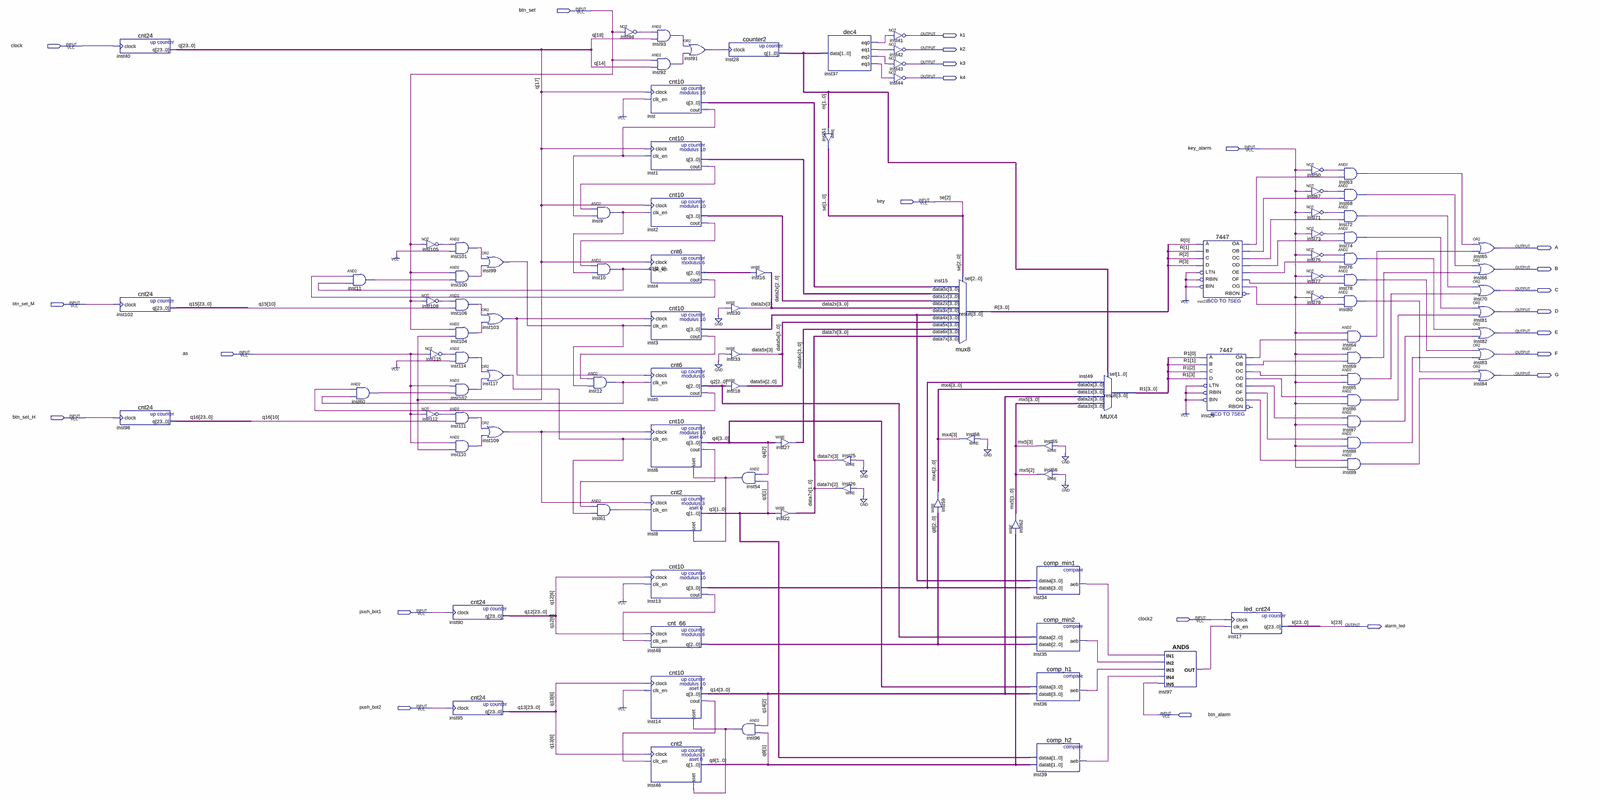
[diagram p0: schematic sheet, whole]
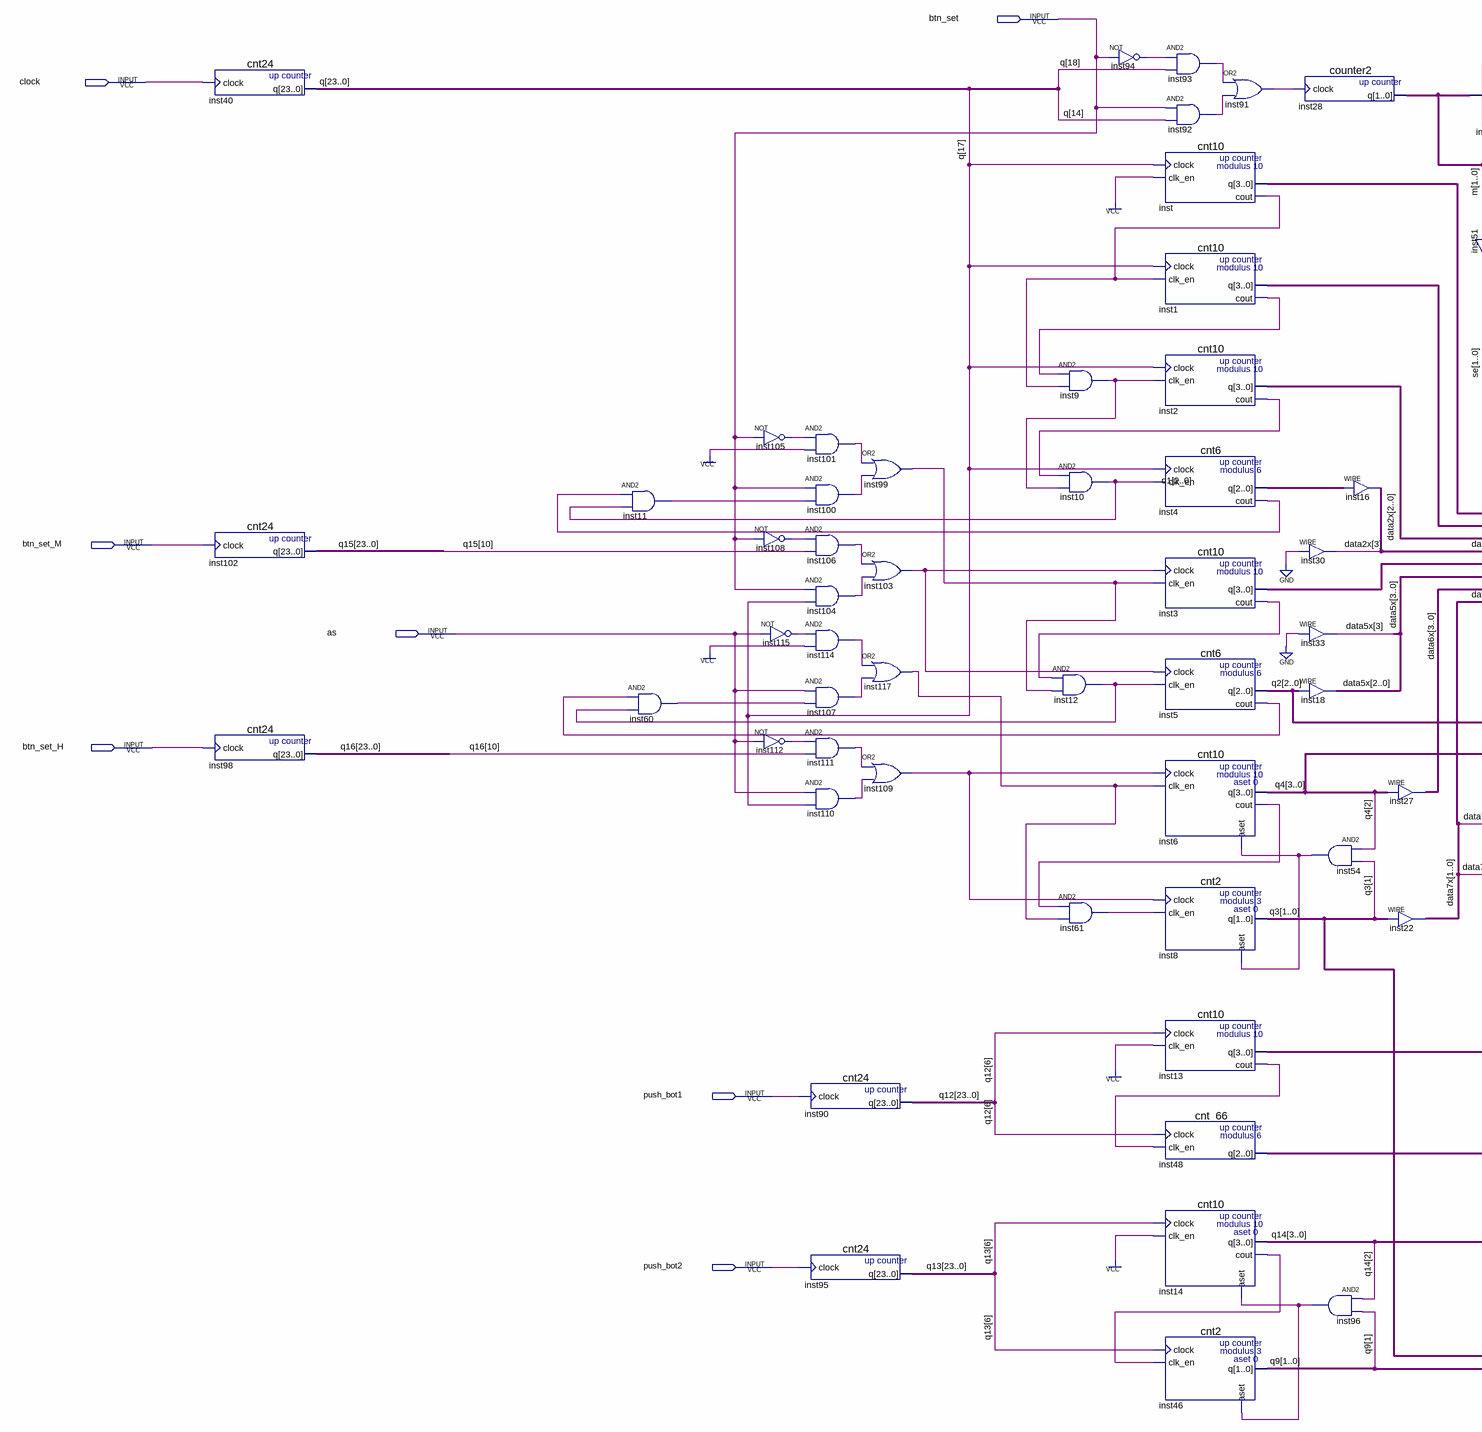
[diagram p1: schematic sheet, left part]
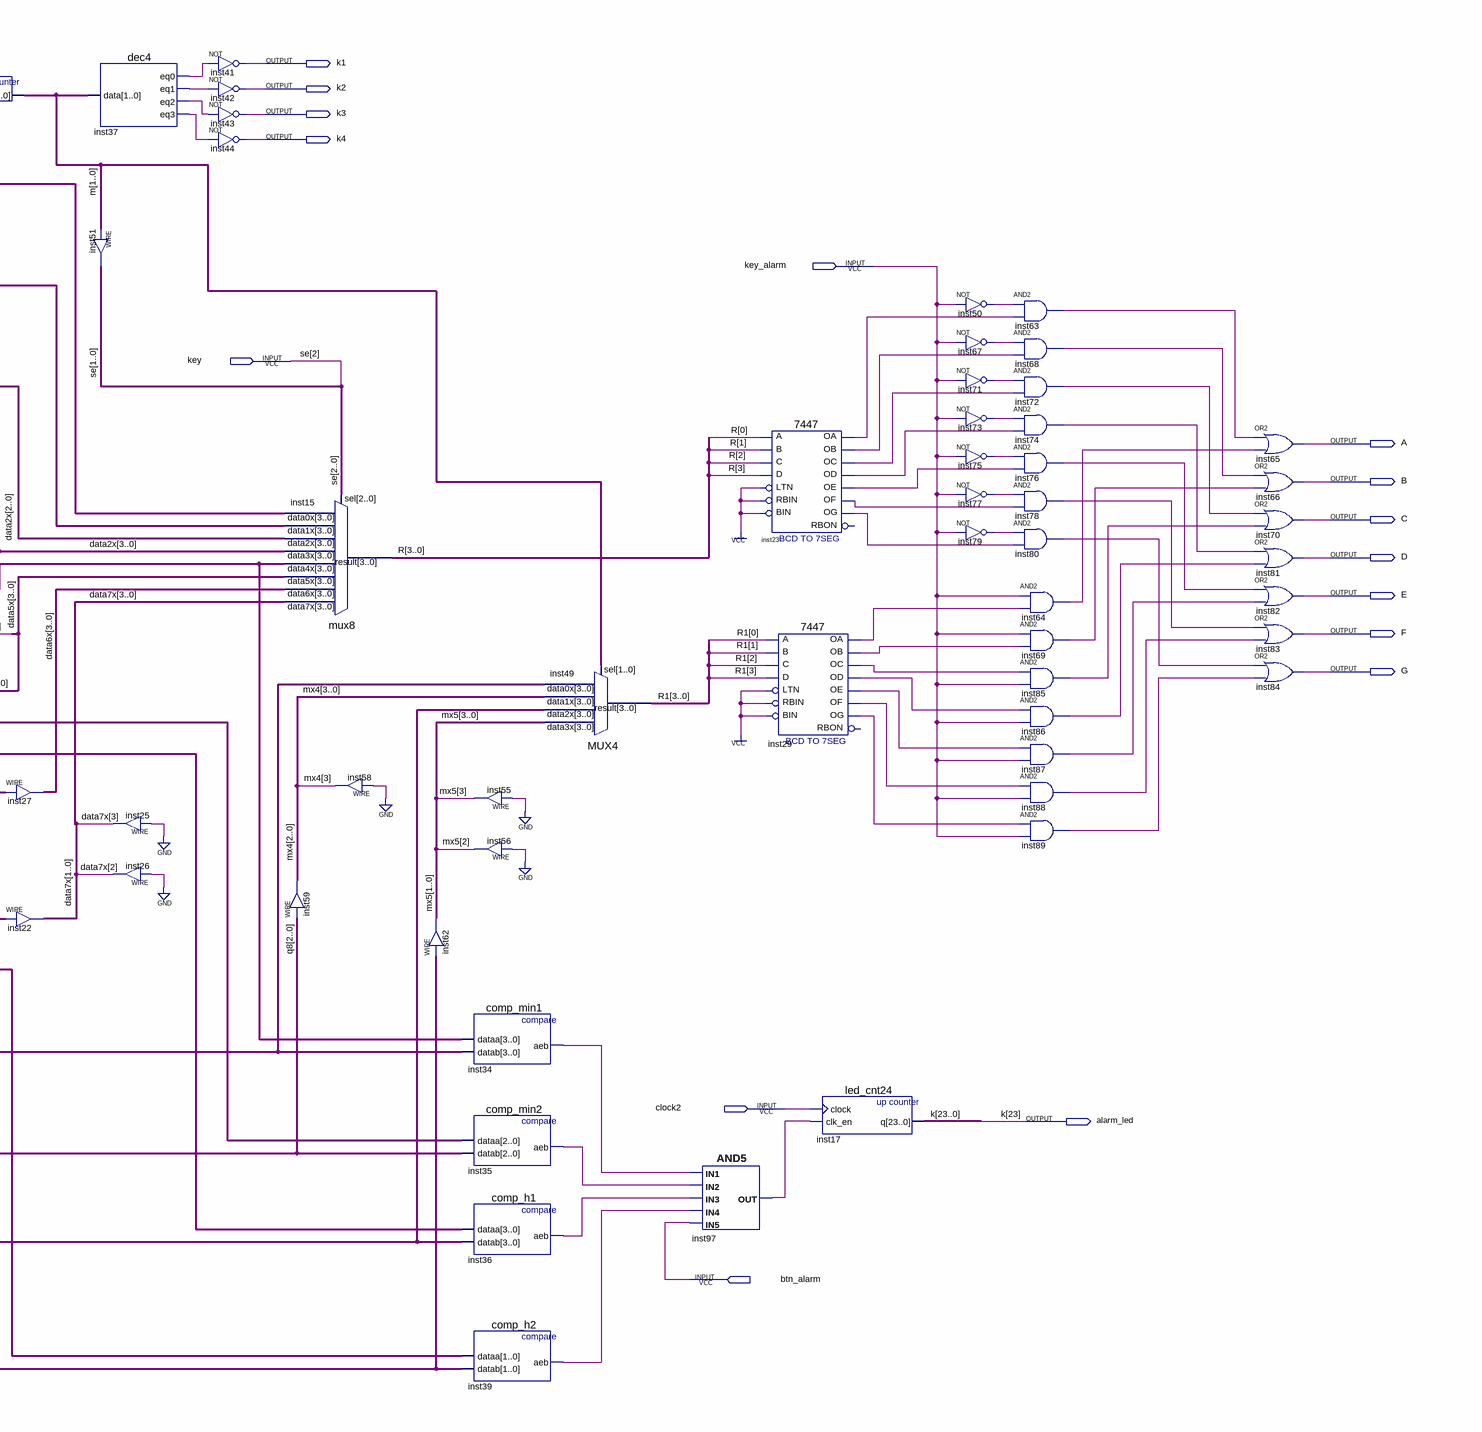
[diagram p2: schematic sheet, right part]
// Quartus schematic digital_clock.bdf as structural Verilog: 103 symbols, 23 pins
module digital_clock (
  input  btn_set,
  input  clock,
  input  key_alarm,
  input  key,
  input  btn_set_M,
  input  as,
  input  btn_set_H,
  input  push_bot1,
  input  clock2,
  input  push_bot2,
  input  btn_alarm,
  output k1,
  output k2,
  output k3,
  output k4,
  output A,
  output B,
  output C,
  output D,
  output E,
  output F,
  output G,
  output alarm_led
);

  wire inst1_cout, inst2_cout, inst3_cout, inst4_cout, inst5_cout, inst6_cout, inst9_out, inst10_out,
       inst11_out, inst12_out, inst13_cout, inst14_cout, inst23_oa, inst23_ob, inst23_oc, inst23_od,
       inst23_oe, inst23_of, inst23_og, inst29_oa, inst29_ob, inst29_oc, inst29_od, inst29_oe, inst29_of,
       inst29_og, inst34_aeb, inst35_aeb, inst36_aeb, inst37_eq0, inst37_eq1, inst37_eq2, inst37_eq3,
       inst39_aeb, inst50_out, inst54_out, inst60_out, inst61_out, inst63_out, inst64_out, inst67_out,
       inst68_out, inst69_out, inst71_out, inst72_out, inst73_out, inst74_out, inst75_out, inst76_out,
       inst77_out, inst78_out, inst79_out, inst80_out, inst85_out, inst86_out, inst87_out, inst88_out,
       inst89_out, inst91_out, inst92_out, inst93_out, inst94_out, inst96_out, inst97_out, inst99_out,
       inst100_out, inst101_out, inst103_out, inst104_out, inst105_out, inst106_out, inst107_out,
       inst108_out, inst109_out, inst110_out, inst111_out, inst112_out, inst114_out, inst115_out,
       inst117_out, inst_cout;
  wire [1:0] m, q3, q9, se;
  wire [2:0] q1, q2, q8;
  wire [3:0] data2x, data5x, data6x, data7x, inst1_q, inst2_q, inst3_q, inst13_q, inst_q, mx4, mx5, q4, q14,
       R, R1;
  wire [22:0] k;
  wire [23:0] q, q12, q13, q15, q16;

  cnt24 inst40 (.clock(clock), .q(q));
  cnt24 inst102 (.clock(btn_set_M), .q(q15));
  cnt24 inst98 (.clock(btn_set_H), .q(q16));
  and inst11 (inst11_out, inst4_cout, inst10_out);
  and inst60 (inst60_out, inst5_cout, inst12_out);
  not inst105 (inst105_out, btn_set);
  not inst108 (inst108_out, btn_set);
  not inst115 (inst115_out, as);
  not inst112 (inst112_out, as);
  and inst101 (inst101_out, inst105_out, 1'b1);
  and inst100 (inst100_out, btn_set, inst11_out);
  and inst106 (inst106_out, inst108_out, q15[10]);
  and inst104 (inst104_out, btn_set, q[17]);
  and inst114 (inst114_out, inst115_out, 1'b1);
  and inst107 (inst107_out, as, inst60_out);
  and inst111 (inst111_out, inst112_out, q16[10]);
  and inst110 (inst110_out, as, q[17]);
  cnt24 inst90 (.clock(push_bot1), .q(q12));
  cnt24 inst95 (.clock(push_bot2), .q(q13));
  or inst99 (inst99_out, inst101_out, inst100_out);
  or inst103 (inst103_out, inst106_out, inst104_out);
  or inst117 (inst117_out, inst114_out, inst107_out);
  or inst109 (inst109_out, inst111_out, inst110_out);
  and inst9 (inst9_out, inst1_cout, inst_cout);
  and inst10 (inst10_out, inst2_cout, inst9_out);
  and inst12 (inst12_out, inst3_cout, inst99_out);
  and inst61 (inst61_out, inst6_cout, inst117_out);
  not inst94 (inst94_out, btn_set);
  and inst93 (inst93_out, inst94_out, q[18]);
  and inst92 (inst92_out, btn_set, q[14]);
  cnt10 inst (.clock(q[17]), .clk_en(1'b1), .q(inst_q), .cout(inst_cout));
  cnt10 inst1 (.clock(q[17]), .clk_en(inst_cout), .q(inst1_q), .cout(inst1_cout));
  cnt10 inst2 (.clock(q[17]), .clk_en(inst9_out), .q(inst2_q), .cout(inst2_cout));
  cnt6 inst4 (.clock(q[17]), .clk_en(inst10_out), .q(q1), .cout(inst4_cout));
  cnt10 inst3 (.clock(inst103_out), .clk_en(inst99_out), .q(inst3_q), .cout(inst3_cout));
  cnt6 inst5 (.clock(inst103_out), .clk_en(inst12_out), .q(q2), .cout(inst5_cout));
  cnt10 inst6 (.clock(inst109_out), .clk_en(inst117_out), .aset(inst54_out), .q(q4), .cout(inst6_cout));
  cnt2 inst8 (.clock(inst109_out), .clk_en(inst61_out), .aset(inst54_out), .q(q3));
  cnt10 inst13 (.clock(q12[6]), .clk_en(1'b1), .q(inst13_q), .cout(inst13_cout));
  cnt_66 inst48 (.clock(q12[6]), .clk_en(inst13_cout), .q(q8));
  cnt10 inst14 (.clock(q13[6]), .clk_en(1'b1), .aset(inst96_out), .q(q14), .cout(inst14_cout));
  cnt2 inst46 (.clock(q13[6]), .clk_en(inst14_cout), .aset(inst96_out), .q(q9));
  or inst91 (inst91_out, inst93_out, inst92_out);
  counter2 inst28 (.clock(inst91_out), .q(m));
  assign data2x[3] = 1'b0;  // WIRE inst30
  assign data5x[3] = 1'b0;  // WIRE inst33
  assign data5x[2:0] = q2;  // WIRE inst18
  and inst54 (inst54_out, q4[2], q3[1]);
  and inst96 (inst96_out, q14[2], q9[1]);
  assign data2x[2:0] = q1;  // WIRE inst16
  assign data6x = q4;  // WIRE inst27
  assign data7x[1:0] = q3;  // WIRE inst22
  dec4 inst37 (.data(m), .eq0(inst37_eq0), .eq1(inst37_eq1), .eq2(inst37_eq2), .eq3(inst37_eq3));
  assign se = m;  // WIRE inst51
  assign data7x[3] = 1'b0;  // WIRE inst25
  assign data7x[2] = 1'b0;  // WIRE inst26
  not inst41 (k1, inst37_eq0);
  not inst42 (k2, inst37_eq1);
  not inst43 (k3, inst37_eq2);
  not inst44 (k4, inst37_eq3);
  mux8 inst15 (
    .data7x(data7x), .data6x(data6x), .data5x(data5x), .data4x(inst3_q), .data3x(data2x), .data2x(inst2_q),
    .data1x(inst1_q), .data0x(inst_q), .sel({key, se}), .result(R));
  assign mx4[2:0] = q8;  // WIRE inst59
  assign mx4[3] = 1'b0;  // WIRE inst58
  assign mx5[1:0] = q9;  // WIRE inst62
  assign mx5[3] = 1'b0;  // WIRE inst55
  assign mx5[2] = 1'b0;  // WIRE inst56
  comp_min1 inst34 (.dataa(inst3_q), .datab(inst13_q), .aeb(inst34_aeb));
  comp_min2 inst35 (.dataa(q2), .datab(q8), .aeb(inst35_aeb));
  comp_h1 inst36 (.dataa(q4), .datab(q14), .aeb(inst36_aeb));
  comp_h2 inst39 (.dataa(q3), .datab(q9), .aeb(inst39_aeb));
  MUX4 inst49 (.data3x(mx5), .data2x(q14), .data1x(mx4), .data0x(inst13_q), .sel(m), .result(R1));
  and inst97 (inst97_out, inst34_aeb, inst35_aeb, inst36_aeb, inst39_aeb, btn_alarm);
  \7447  inst23 (
    .LTN(1'b1), .B(R[1]), .C(R[2]), .D(R[3]), .RBIN(1'b1), .BIN(1'b1), .A(R[0]), .OB(inst23_ob),
    .OC(inst23_oc), .OE(inst23_oe), .OD(inst23_od), .OF(inst23_of), .OG(inst23_og), .OA(inst23_oa));  // open: RBON
  \7447  inst29 (
    .LTN(1'b1), .B(R1[1]), .C(R1[2]), .D(R1[3]), .RBIN(1'b1), .BIN(1'b1), .A(R1[0]), .OB(inst29_ob),
    .OC(inst29_oc), .OE(inst29_oe), .OD(inst29_od), .OF(inst29_of), .OG(inst29_og), .OA(inst29_oa));  // open: RBON
  led_cnt24 inst17 (.clock(clock2), .clk_en(inst97_out), .q({alarm_led, k[22:5], k4, k3, k2, k1, k[0]}));
  not inst50 (inst50_out, key_alarm);
  not inst67 (inst67_out, key_alarm);
  not inst71 (inst71_out, key_alarm);
  not inst73 (inst73_out, key_alarm);
  not inst75 (inst75_out, key_alarm);
  not inst77 (inst77_out, key_alarm);
  not inst79 (inst79_out, key_alarm);
  and inst63 (inst63_out, inst50_out, inst23_oa);
  and inst68 (inst68_out, inst67_out, inst23_ob);
  and inst72 (inst72_out, inst71_out, inst23_oc);
  and inst74 (inst74_out, inst73_out, inst23_od);
  and inst76 (inst76_out, inst75_out, inst23_oe);
  and inst78 (inst78_out, inst77_out, inst23_of);
  and inst80 (inst80_out, inst79_out, inst23_og);
  and inst64 (inst64_out, key_alarm, inst29_oa);
  and inst69 (inst69_out, key_alarm, inst29_ob);
  and inst85 (inst85_out, inst29_oc, key_alarm);
  and inst86 (inst86_out, inst29_od, key_alarm);
  and inst87 (inst87_out, inst29_oe, key_alarm);
  and inst88 (inst88_out, inst29_of, key_alarm);
  and inst89 (inst89_out, inst29_og, key_alarm);
  or inst65 (A, inst63_out, inst64_out);
  or inst66 (B, inst68_out, inst69_out);
  or inst70 (C, inst72_out, inst85_out);
  or inst81 (D, inst74_out, inst86_out);
  or inst82 (E, inst76_out, inst87_out);
  or inst83 (F, inst78_out, inst88_out);
  or inst84 (G, inst80_out, inst89_out);

  // Other names for the same wires on the sheet: k[23] = alarm_led; se[2] = key
endmodule
